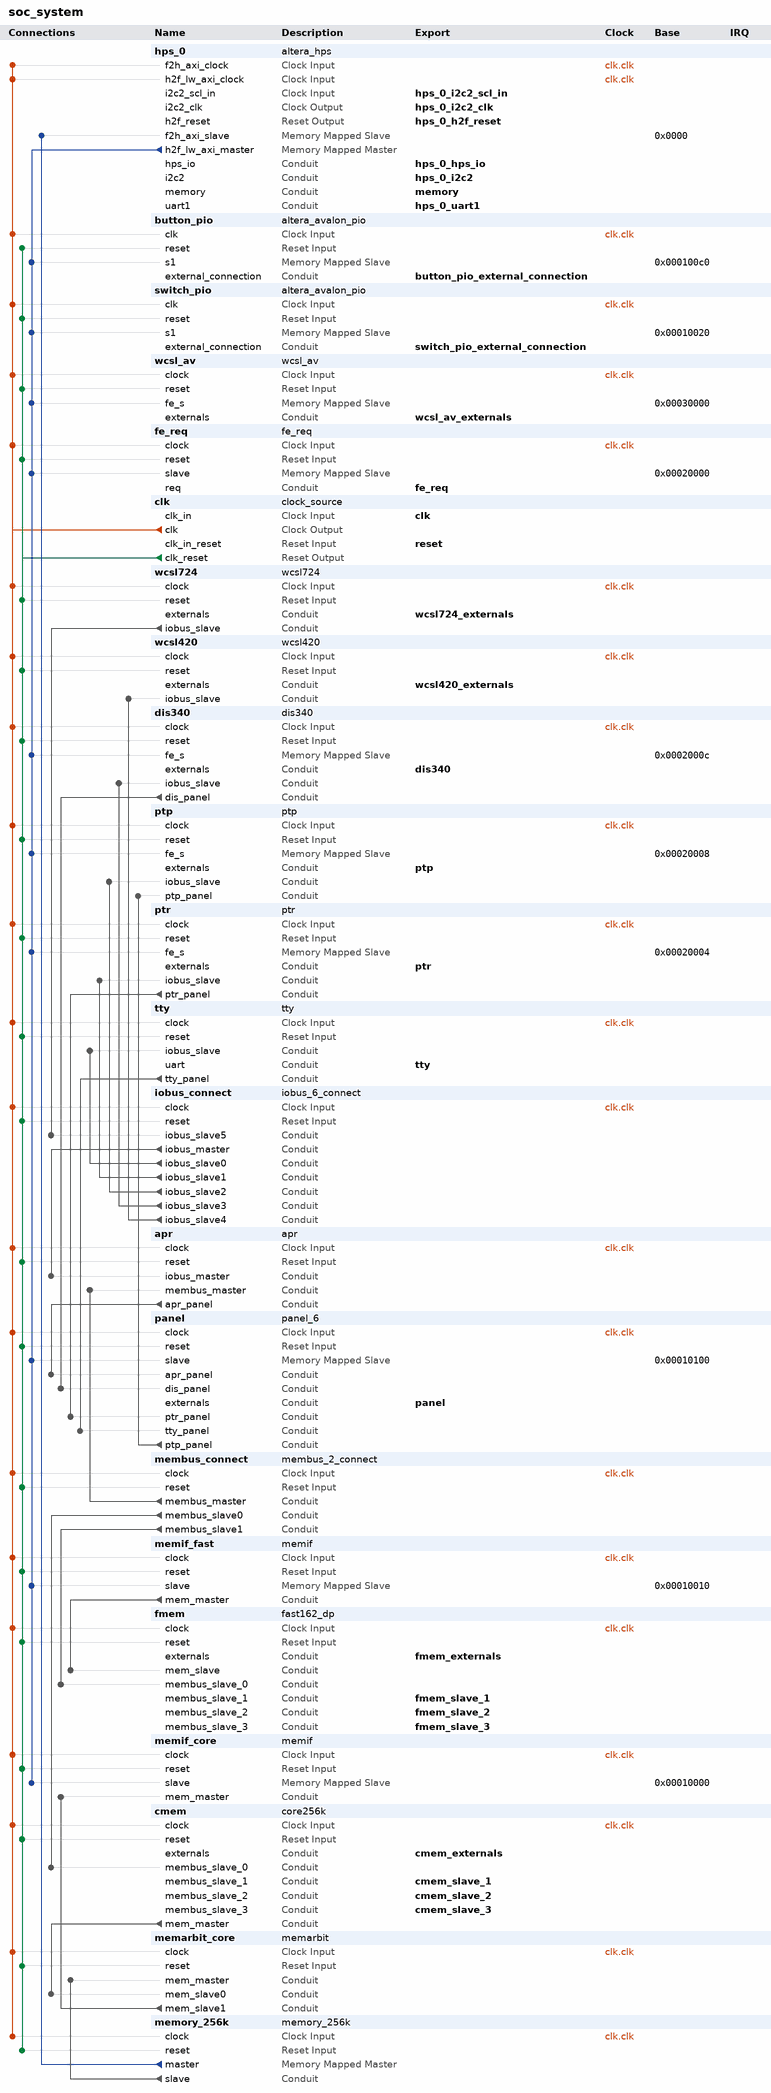
[diagram p0: system contents]
# Platform Designer (Qsys) system soc_system, Cyclone V 5CSEMA4U23C6
# Parameters at their usual value, and those the tool derives, are not listed.
package require -exact qsys 18.0
create_system soc_system
set_project_property DEVICE_FAMILY {Cyclone V}
set_project_property DEVICE 5CSEMA4U23C6

add_instance hps_0 altera_hps 18.0
set_instance_parameter_value hps_0 EMAC1_Mode RGMII
set_instance_parameter_value hps_0 EMAC1_PinMuxing {HPS I/O Set 0}
set_instance_parameter_value hps_0 F2SCLK_COLDRST_Enable false
set_instance_parameter_value hps_0 F2SCLK_DBGRST_Enable false
set_instance_parameter_value hps_0 F2SCLK_WARMRST_Enable false
set_instance_parameter_value hps_0 F2SINTERRUPT_Enable false
set_instance_parameter_value hps_0 F2S_Width 2
set_instance_parameter_value hps_0 FPGA_PERIPHERAL_OUTPUT_CLOCK_FREQ_EMAC0_GTX_CLK 100
set_instance_parameter_value hps_0 FPGA_PERIPHERAL_OUTPUT_CLOCK_FREQ_EMAC0_MD_CLK 100.0
set_instance_parameter_value hps_0 FPGA_PERIPHERAL_OUTPUT_CLOCK_FREQ_EMAC1_GTX_CLK 100
set_instance_parameter_value hps_0 FPGA_PERIPHERAL_OUTPUT_CLOCK_FREQ_EMAC1_MD_CLK 100.0
set_instance_parameter_value hps_0 HPS_PROTOCOL DDR3
set_instance_parameter_value hps_0 I2C0_Mode I2C
set_instance_parameter_value hps_0 I2C0_PinMuxing {HPS I/O Set 0}
set_instance_parameter_value hps_0 I2C1_Mode I2C
set_instance_parameter_value hps_0 I2C1_PinMuxing {HPS I/O Set 0}
set_instance_parameter_value hps_0 I2C2_Mode Full
set_instance_parameter_value hps_0 I2C2_PinMuxing FPGA
set_instance_parameter_value hps_0 LWH2F_Enable true
set_instance_parameter_value hps_0 MEM_BANKADDR_WIDTH 3
set_instance_parameter_value hps_0 MEM_CLK_FREQ 400.0
set_instance_parameter_value hps_0 MEM_COL_ADDR_WIDTH 10
set_instance_parameter_value hps_0 MEM_DQ_WIDTH 32
set_instance_parameter_value hps_0 MEM_DRV_STR RZQ/6
set_instance_parameter_value hps_0 MEM_ROW_ADDR_WIDTH 15
set_instance_parameter_value hps_0 MEM_RTT_NOM RZQ/6
set_instance_parameter_value hps_0 MEM_RTT_WR {Dynamic ODT off}
set_instance_parameter_value hps_0 MEM_TCL 7
set_instance_parameter_value hps_0 MEM_TFAW_NS 37.5
set_instance_parameter_value hps_0 MEM_TRAS_NS 35.0
set_instance_parameter_value hps_0 MEM_TRCD_NS 13.75
set_instance_parameter_value hps_0 MEM_TRFC_NS 300.0
set_instance_parameter_value hps_0 MEM_TRP_NS 13.75
set_instance_parameter_value hps_0 MEM_VENDOR Other
set_instance_parameter_value hps_0 MEM_WTCL 7
set_instance_parameter_value hps_0 QSPI_Mode N/A
set_instance_parameter_value hps_0 QSPI_PinMuxing Unused
set_instance_parameter_value hps_0 REF_CLK_FREQ 25.0
set_instance_parameter_value hps_0 S2FCLK_USER2CLK 5
set_instance_parameter_value hps_0 S2F_Width 0
set_instance_parameter_value hps_0 SDIO_Mode {4-bit Data}
set_instance_parameter_value hps_0 SDIO_PinMuxing {HPS I/O Set 0}
set_instance_parameter_value hps_0 SPIM1_Mode {Single Slave Select}
set_instance_parameter_value hps_0 SPIM1_PinMuxing {HPS I/O Set 0}
set_instance_parameter_value hps_0 STM_Enable false
set_instance_parameter_value hps_0 TIMING_BOARD_AC_SKEW 0.02
set_instance_parameter_value hps_0 TIMING_BOARD_AC_TO_CK_SKEW 0.0
set_instance_parameter_value hps_0 TIMING_BOARD_DQ_TO_DQS_SKEW 0.0
set_instance_parameter_value hps_0 TIMING_BOARD_MAX_CK_DELAY 0.6
set_instance_parameter_value hps_0 TIMING_BOARD_MAX_DQS_DELAY 0.6
set_instance_parameter_value hps_0 TIMING_BOARD_SKEW_BETWEEN_DQS 0.02
set_instance_parameter_value hps_0 TIMING_BOARD_SKEW_CKDQS_DIMM_MAX 0.01
set_instance_parameter_value hps_0 TIMING_BOARD_SKEW_CKDQS_DIMM_MIN -0.01
set_instance_parameter_value hps_0 TIMING_BOARD_SKEW_WITHIN_DQS 0.02
set_instance_parameter_value hps_0 TIMING_TDH 125
set_instance_parameter_value hps_0 TIMING_TDQSCK 400
set_instance_parameter_value hps_0 TIMING_TDQSQ 120
set_instance_parameter_value hps_0 TIMING_TDS 50
set_instance_parameter_value hps_0 TIMING_TIH 250
set_instance_parameter_value hps_0 TIMING_TIS 175
set_instance_parameter_value hps_0 TIMING_TQSH 0.38
set_instance_parameter_value hps_0 UART0_Mode {No Flow Control}
set_instance_parameter_value hps_0 UART0_PinMuxing {HPS I/O Set 0}
set_instance_parameter_value hps_0 UART1_Mode Full
set_instance_parameter_value hps_0 UART1_PinMuxing FPGA
set_instance_parameter_value hps_0 USB1_Mode SDR
set_instance_parameter_value hps_0 USB1_PinMuxing {HPS I/O Set 0}
set_instance_parameter_value hps_0 desired_cfg_clk_mhz 100.0
set_instance_parameter_value hps_0 desired_qspi_clk_mhz 370.0

add_instance button_pio altera_avalon_pio 18.0
set_instance_parameter_value button_pio bitClearingEdgeCapReg true
set_instance_parameter_value button_pio captureEdge true
set_instance_parameter_value button_pio direction Input
set_instance_parameter_value button_pio edgeType FALLING
set_instance_parameter_value button_pio irqType EDGE
set_instance_parameter_value button_pio width 4

add_instance switch_pio altera_avalon_pio 18.0
set_instance_parameter_value switch_pio direction Input
set_instance_parameter_value switch_pio width 4

add_instance wcsl_av wcsl_av 1.0

add_instance fe_req fe_req 1.0

add_instance clk clock_source 18.0
set_instance_parameter_value clk clockFrequency 50000000

add_instance wcsl724 wcsl724 1.0

add_instance wcsl420 wcsl420 1.0

add_instance dis340 dis340 1.0

add_instance ptp ptp 1.0

add_instance ptr ptr 1.0

add_instance tty tty 1.0

add_instance iobus_connect iobus_6_connect 1.0

add_instance apr apr 1.0

add_instance panel panel_6 1.0

add_instance membus_connect membus_2_connect 1.0

add_instance memif_fast memif 1.0

add_instance fmem fast162_dp 1.0
set_instance_parameter_value fmem fmc_p0_sel 1
set_instance_parameter_value fmem fmc_p1_sel 0
set_instance_parameter_value fmem fmc_p2_sel 0
set_instance_parameter_value fmem fmc_p3_sel 0
set_instance_parameter_value fmem memsel_p0 0
set_instance_parameter_value fmem memsel_p1 0
set_instance_parameter_value fmem memsel_p2 0
set_instance_parameter_value fmem memsel_p3 0

add_instance memif_core memif 1.0

add_instance cmem core256k 1.0

add_instance memarbit_core memarbit 1.0

add_instance memory_256k memory_256k 1.0
set_instance_parameter_value memory_256k base_addr 805306368

# connections
add_connection clk.clk apr.clock clock
add_connection clk.clk button_pio.clk clock
add_connection clk.clk cmem.clock clock
add_connection clk.clk dis340.clock clock
add_connection clk.clk fe_req.clock clock
add_connection clk.clk fmem.clock clock
add_connection clk.clk hps_0.f2h_axi_clock clock
add_connection clk.clk hps_0.h2f_lw_axi_clock clock
add_connection clk.clk iobus_connect.clock clock
add_connection clk.clk memarbit_core.clock clock
add_connection clk.clk membus_connect.clock clock
add_connection clk.clk memif_core.clock clock
add_connection clk.clk memif_fast.clock clock
add_connection clk.clk memory_256k.clock clock
add_connection clk.clk panel.clock clock
add_connection clk.clk ptp.clock clock
add_connection clk.clk ptr.clock clock
add_connection clk.clk switch_pio.clk clock
add_connection clk.clk tty.clock clock
add_connection clk.clk wcsl420.clock clock
add_connection clk.clk wcsl724.clock clock
add_connection clk.clk wcsl_av.clock clock
add_connection clk.clk_reset apr.reset reset
add_connection clk.clk_reset button_pio.reset reset
add_connection clk.clk_reset cmem.reset reset
add_connection clk.clk_reset dis340.reset reset
add_connection clk.clk_reset fe_req.reset reset
add_connection clk.clk_reset fmem.reset reset
add_connection clk.clk_reset iobus_connect.reset reset
add_connection clk.clk_reset memarbit_core.reset reset
add_connection clk.clk_reset membus_connect.reset reset
add_connection clk.clk_reset memif_core.reset reset
add_connection clk.clk_reset memif_fast.reset reset
add_connection clk.clk_reset memory_256k.reset reset
add_connection clk.clk_reset panel.reset reset
add_connection clk.clk_reset ptp.reset reset
add_connection clk.clk_reset ptr.reset reset
add_connection clk.clk_reset switch_pio.reset reset
add_connection clk.clk_reset tty.reset reset
add_connection clk.clk_reset wcsl420.reset reset
add_connection clk.clk_reset wcsl724.reset reset
add_connection clk.clk_reset wcsl_av.reset reset
add_connection hps_0.h2f_lw_axi_master button_pio.s1 avalon
set_connection_parameter_value hps_0.h2f_lw_axi_master/button_pio.s1 baseAddress 0x000100c0
add_connection hps_0.h2f_lw_axi_master dis340.fe_s avalon
set_connection_parameter_value hps_0.h2f_lw_axi_master/dis340.fe_s baseAddress 0x0002000c
add_connection hps_0.h2f_lw_axi_master fe_req.slave avalon
set_connection_parameter_value hps_0.h2f_lw_axi_master/fe_req.slave baseAddress 0x00020000
add_connection hps_0.h2f_lw_axi_master memif_core.slave avalon
set_connection_parameter_value hps_0.h2f_lw_axi_master/memif_core.slave baseAddress 0x00010000
add_connection hps_0.h2f_lw_axi_master memif_fast.slave avalon
set_connection_parameter_value hps_0.h2f_lw_axi_master/memif_fast.slave baseAddress 0x00010010
add_connection hps_0.h2f_lw_axi_master panel.slave avalon
set_connection_parameter_value hps_0.h2f_lw_axi_master/panel.slave baseAddress 0x00010100
add_connection hps_0.h2f_lw_axi_master ptp.fe_s avalon
set_connection_parameter_value hps_0.h2f_lw_axi_master/ptp.fe_s baseAddress 0x00020008
add_connection hps_0.h2f_lw_axi_master ptr.fe_s avalon
set_connection_parameter_value hps_0.h2f_lw_axi_master/ptr.fe_s baseAddress 0x00020004
add_connection hps_0.h2f_lw_axi_master switch_pio.s1 avalon
set_connection_parameter_value hps_0.h2f_lw_axi_master/switch_pio.s1 baseAddress 0x00010020
set_connection_parameter_value hps_0.h2f_lw_axi_master/switch_pio.s1 defaultConnection true
add_connection hps_0.h2f_lw_axi_master wcsl_av.fe_s avalon
set_connection_parameter_value hps_0.h2f_lw_axi_master/wcsl_av.fe_s baseAddress 0x00030000
add_connection memory_256k.master hps_0.f2h_axi_slave avalon
set_connection_parameter_value memory_256k.master/hps_0.f2h_axi_slave baseAddress 0x0000
add_connection apr.apr_panel panel.apr_panel conduit
add_connection cmem.mem_master memarbit_core.mem_slave0 conduit
add_connection dis340.dis_panel panel.dis_panel conduit
add_connection iobus_connect.iobus_master apr.iobus_master conduit
add_connection iobus_connect.iobus_slave0 tty.iobus_slave conduit
add_connection iobus_connect.iobus_slave1 ptr.iobus_slave conduit
add_connection iobus_connect.iobus_slave2 ptp.iobus_slave conduit
add_connection iobus_connect.iobus_slave3 dis340.iobus_slave conduit
add_connection iobus_connect.iobus_slave4 wcsl420.iobus_slave conduit
add_connection memarbit_core.mem_slave1 memif_core.mem_master conduit
add_connection membus_connect.membus_master apr.membus_master conduit
add_connection membus_connect.membus_slave0 cmem.membus_slave_0 conduit
add_connection membus_connect.membus_slave1 fmem.membus_slave_0 conduit
add_connection memif_fast.mem_master fmem.mem_slave conduit
add_connection memory_256k.slave memarbit_core.mem_master conduit
add_connection panel.ptp_panel ptp.ptp_panel conduit
add_connection ptr.ptr_panel panel.ptr_panel conduit
add_connection tty.tty_panel panel.tty_panel conduit
add_connection wcsl724.iobus_slave iobus_connect.iobus_slave5 conduit

# exported interfaces
add_interface button_pio_external_connection conduit end
set_interface_property button_pio_external_connection EXPORT_OF button_pio.external_connection
add_interface clk clock sink
set_interface_property clk EXPORT_OF clk.clk_in
add_interface cmem_externals conduit end
set_interface_property cmem_externals EXPORT_OF cmem.externals
add_interface cmem_slave_1 conduit end
set_interface_property cmem_slave_1 EXPORT_OF cmem.membus_slave_1
add_interface cmem_slave_2 conduit end
set_interface_property cmem_slave_2 EXPORT_OF cmem.membus_slave_2
add_interface cmem_slave_3 conduit end
set_interface_property cmem_slave_3 EXPORT_OF cmem.membus_slave_3
add_interface dis340 conduit end
set_interface_property dis340 EXPORT_OF dis340.externals
add_interface fe_req conduit end
set_interface_property fe_req EXPORT_OF fe_req.req
add_interface fmem_externals conduit end
set_interface_property fmem_externals EXPORT_OF fmem.externals
add_interface fmem_slave_1 conduit end
set_interface_property fmem_slave_1 EXPORT_OF fmem.membus_slave_1
add_interface fmem_slave_2 conduit end
set_interface_property fmem_slave_2 EXPORT_OF fmem.membus_slave_2
add_interface fmem_slave_3 conduit end
set_interface_property fmem_slave_3 EXPORT_OF fmem.membus_slave_3
add_interface hps_0_h2f_reset reset source
set_interface_property hps_0_h2f_reset EXPORT_OF hps_0.h2f_reset
add_interface hps_0_hps_io conduit end
set_interface_property hps_0_hps_io EXPORT_OF hps_0.hps_io
add_interface hps_0_i2c2 conduit end
set_interface_property hps_0_i2c2 EXPORT_OF hps_0.i2c2
add_interface hps_0_i2c2_clk clock source
set_interface_property hps_0_i2c2_clk EXPORT_OF hps_0.i2c2_clk
add_interface hps_0_i2c2_scl_in clock sink
set_interface_property hps_0_i2c2_scl_in EXPORT_OF hps_0.i2c2_scl_in
add_interface hps_0_uart1 conduit end
set_interface_property hps_0_uart1 EXPORT_OF hps_0.uart1
add_interface memory conduit end
set_interface_property memory EXPORT_OF hps_0.memory
add_interface panel conduit end
set_interface_property panel EXPORT_OF panel.externals
add_interface ptp conduit end
set_interface_property ptp EXPORT_OF ptp.externals
add_interface ptr conduit end
set_interface_property ptr EXPORT_OF ptr.externals
add_interface reset reset sink
set_interface_property reset EXPORT_OF clk.clk_in_reset
add_interface switch_pio_external_connection conduit end
set_interface_property switch_pio_external_connection EXPORT_OF switch_pio.external_connection
add_interface tty conduit end
set_interface_property tty EXPORT_OF tty.uart
add_interface wcsl420_externals conduit end
set_interface_property wcsl420_externals EXPORT_OF wcsl420.externals
add_interface wcsl724_externals conduit end
set_interface_property wcsl724_externals EXPORT_OF wcsl724.externals
add_interface wcsl_av_externals conduit end
set_interface_property wcsl_av_externals EXPORT_OF wcsl_av.externals

set_interconnect_requirement {$system} qsys_mm.clockCrossingAdapter HANDSHAKE
set_interconnect_requirement {$system} qsys_mm.maxAdditionalLatency 1
set_interconnect_requirement memif_d_1.master qsys_mm.security SECURE
set_interconnect_requirement memif_d_1.slave qsys_mm.security NON_SECURE

save_system soc_system.qsys
